# EAGLE design Breadboard (EAGLE 9.6.2)
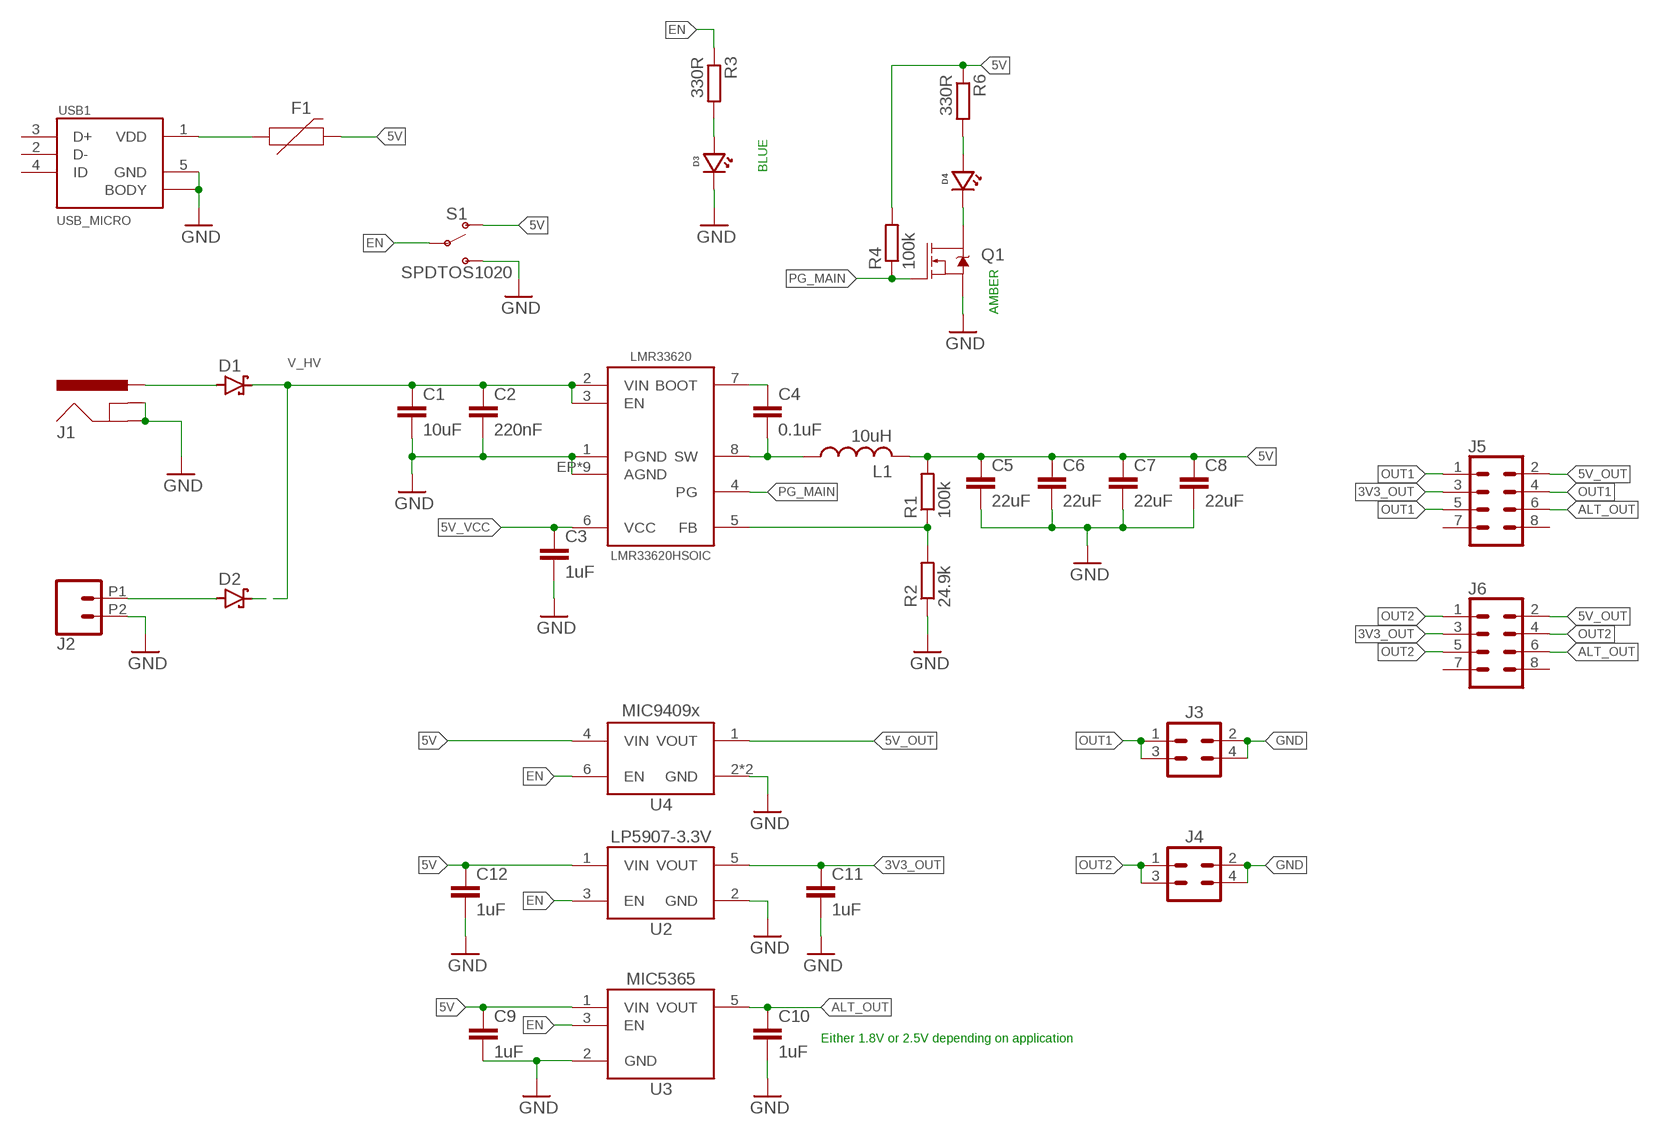
[diagram p0: schematic, sheet 1]

## Parts
C1  10uF  C-EU10UFC0805  [C0805]
C2  220nF  C-EUC0603  [C0603]
C3  1uF  C-EU1UFC0603  [C0603]
C4  0.1uF  C-EU0.1UFC0603  [C0603]
C5  22uF  C-EU22UFC0805  [C0805]
C6  22uF  C-EU22UFC0805  [C0805]
C7  22uF  C-EU22UFC0805  [C0805]
C8  22uF  C-EU22UFC0805  [C0805]
C9  1uF  C-EU1UFC0603  [C0603]
C10  1uF  C-EU1UFC0603  [C0603]
C11  1uF  C-EU1UFC0603  [C0603]
C12  1uF  C-EU1UFC0603  [C0603]
D1  DIODE_SCHOTTKYSOD-123  [SOD-123]
D2  DIODE_SCHOTTKYSOD-123  [SOD-123]
D3  LEDBLUE0603  [LED_0603]
D4  LEDAMBER0603  [LED_0603]
F1  PPTC_HALF-AMP  [1206]
J1  POWER_JACKSLT  [POWER_JACK_SLOT]
J2  CONN_022.54_SCREW  [1X02_2.54_SCREWTERM]
J3  CONN_2X2  [2X02]
J4  CONN_2X2  [2X02]
J5  CONN_04X2  [2X4]
J6  CONN_04X2  [2X4]
L1  10uH  INDUCTORLQS_5X5  [WE-LQS(5X5)]
Q1  MOSFET-NCH-2N7002P  [SOT23-3]
R1  100k  R-EU_100KR0603  [R0603]
R2  24.9k  R-EU_R0603  [R0603]
R3  330R  R-EU_330R0603  [R0603]
R4  100k  R-EU_100KR0603  [R0603]
R6  330R  R-EU_330R0603  [R0603]
S1  SPDTOS1020  [OS102011MS2QN1]
U1  LMR33620HSOIC  [DDS0008J]
U2  LP59073.3VDBV  [SOT23-5]
U3  MIC53651.8SOT23  [SOT23-5]
U4  MIC9409C6  [SC-70_6]
USB1  USB_MICRO  [10118194-0001LF_10118194-0001LF_LONGER_PADS]

## Nets
3V3_OUT: C11.1 J5.3 J6.3 U2.5(VOUT)
5V: C5.1 C6.1 C7.1 C8.1 C9.1 C12.1 F1.2 L1.2 R1.2 R4.2 R6.1 S1.1(O) U2.1(VIN) U3.1(VIN) U4.4(VIN)
5V_OUT: J5.2 J6.2 U4.1(VOUT)
5V_VCC: C3.1 U1.6(VCC)
ALT_OUT: C10.1 J5.6 J6.6 U3.5(VOUT)
EN: R3.1 S1.2(P) U2.3(EN) U3.3(EN) U4.6(EN)
GND: C1.2 C2.2 C3.2 C5.2 C6.2 C7.2 C8.2 C9.2 C10.2 C11.2 C12.2 D3.CATHODE J1.GND@1(GNDBREAK) J1.GND@2(GND) J2.P2 J3.2 J3.4 J4.2 J4.4 Q1.2(S) R2.1 S1.3(S) U1.1(PGND) U1.EP(AGND) U1.EP@1(AGND) U1.EP@2(AGND) U1.EP@3(AGND) U1.EP@4(AGND) U1.EP@5(AGND) U1.EP@6(AGND) U1.EP@7(AGND) U1.EP@8(AGND) U2.2(GND) U3.2(GND) U4.2(GND) U4.5(GND) USB1.5(GND) USB1.BODY@1(BODY) USB1.BODY@2(BODY) USB1.BODY@3(BODY) USB1.BODY@4(BODY) USB1.BODY@7(BODY) USB1.BODY@8(BODY)
N$1: R1.1 R2.2 U1.5(FB)
N$2: D1.ANODE(A) J1.PWR
N$3: D2.ANODE(A) J2.P1
N$4: F1.1 USB1.1(VDD)
N$5: C4.2 L1.1 U1.8(SW)
N$6: C4.1 U1.7(BOOT)
N$9: D4.CATHODE Q1.3(D)
N$11: D3.ANODE R3.2
N$12: D4.ANODE R6.2
OUT1: J3.1 J3.3 J5.1 J5.4 J5.5
OUT2: J4.1 J4.3 J6.1 J6.4 J6.5
PG_MAIN: Q1.1(G) R4.1 U1.4(PG)
V_HV: C1.1 C2.1 D1.CAT(C) D2.CAT(C) U1.2(VIN) U1.3(EN)
Unconnected: J5.7 J5.8 J6.7 J6.8 USB1.2(D-) USB1.3(D+) USB1.4(ID)

## Notes on the sheet
- BLUE
- AMBER
- Either 1.8V or 2.5V depending on application

## Library data of the parts
C1 = bschulz_passives:C-EU: CAPACITOR, European symbol; DIGIKEY: 490-6473-6-ND; MF: Murata; MPN: GRM21BR61C106KE15K
C2 = bschulz_passives:C-EU: CAPACITOR, European symbol
C3 C9-C12 = bschulz_passives:C-EU: CAPACITOR, European symbol; DIGIKEY: 587-1251-1-ND; MF: Yaiyo Yuden; MPN: EMK107BJ105KA-T
C4 = bschulz_passives:C-EU: CAPACITOR, European symbol; DIGIKEY: 490-6051-1-ND; MF: Murata; MPN: GCM188R71E104KA57D
C5-C8 = bschulz_passives:C-EU: CAPACITOR, European symbol; DIGIKEY: 490-9952-1-ND; MF: Murata; MPN: GRM219R61C226ME15L
D1 D2 = bschulz:DIODE_SCHOTTKY: Generic Shottky Diode
D3 = bschulz:LED: Genaric LED; DIGIKEY: 732-4966-1-ND; MF: Wurth; MPN: 150060BS75000
D4 = bschulz:LED: Genaric LED; DIGIKEY: 732-150060AS75000CT-ND; MF: Wurth; MPN: 150060AS75000
F1 = bschulz:PPTC: Bel Fuse PPTC; DIGIKEY: MF-NSMF020-2CT-ND; MF: Bourns; MPN: MF-NSMF020-2
J1 = bschulz:POWER_JACK: Power Jack Connector This is the standard 5.5mm barrel jack for power. The PTH is the most common, proven, reliable, footprint. The Slot footprint only works if the mill layer is transmitted to the PCB fab house so be warned. Here are the connectors we sell at SparkFun: DC Barrel Power Jack/Connector <https://www.sparkfun.com/products/119> (PRT-00119) DC Barrel Power Jack/Connector (SMD) <https://www.sparkfun.com/products/12748> (PRT-12748) DC Barrel Jack Adapter - Breadboard Compatible <https://www.sparkfun.com/products/10811> (PRT-10811) It is used on this SparkFun product (and many, many others): SparkFun RedBoard - Programmed with Arduino <https://www.sparkfun.com/products/12757> (DEV-12757) Also, if you need a mating power supply or connector, please check these out: Wall Adapter Power Supply - 9VDC 650mA <https://www.sparkfun.com/products/298> (TOL-00298) DC Barrel Jack Adapter - Male <https://www.sparkfun.com/products/10287> (PRT-10287); PROD_ID: PRT-00119
J2 = bschulz:CONN_02: Genaric 2 terminal header SCREW_2.54 <https://www.digikey.com/product-detail/en/on-shore-technology-inc/OSTVN02A150/ED10561-ND/1588862> 39532_RA <https://www.digikey.com/product-detail/en/molex/0395321002/WM7845-ND/1280696>; DIGIKEY: ED10561-ND; MF: OnShore; MPN: OSTVN02A150
J3 J4 = bschulz:CONN_2X2: Genaric 2x2 terminal header
J5 J6 = bschulz:CONN_04X2: Multi connection point. Often used as Generic Header-pin footprint for 0.1 inch spaced/style header connections On any of the 0.1 inch spaced packages, you can populate with these: Break Away Headers - Straight <https://www.sparkfun.com/products/116> (PRT-00116) Break Away Male Headers - Right Angle <https://www.sparkfun.com/products/553> (PRT-00553) Female Headers <https://www.sparkfun.com/products/115> (PRT-00115) Break Away Headers - Machine Pin <https://www.sparkfun.com/products/117> (PRT-00117) Break Away Female Headers - Swiss Machine Pin <https://www.sparkfun.com/products/743> (PRT-00743)
L1 = bschulz:INDUCTOR: Genaric inductor
Q1 = bschulz:MOSFET-NCH: N-channel MOSFETs Voltage controlled devices that allow control of high current outputs. SparkFun Products: SparkFun OpenScale <https://www.sparkfun.com/products/13261> SparkFun Digital Sandbox <https://www.sparkfun.com/products/12651> SparkFun Monster Moto Shield <https://www.sparkfun.com/products/10182> SparkFun MOSFET Power Controller <https://www.sparkfun.com/products/11214>; DIGIKEY: 1727-4692-1-ND; MF: Nexperia; MPN: 2N7002P,215
R1 R4 = bschulz_passives:R-EU_: RESISTOR, European symbol Digikey Parts: Yageo, 0402 <https://www.digikey.com/products/en/resistors/chip-resistor-surface-mount/52?k=&pkeyword=&sv=0&s=4356&sf=1&FV=-1%7C13%2C7%7C2%2C1291%7C39157%2C1989%7C0%2C-8%7C52%2C3%7C1131%2C3%7C2503&quantity=&ColumnSort=0&page=1&stock=1&pageSize=25> Yageo, 0603 <https://www.digikey.com/products/en/resistors/chip-resistor-surface-mount/52?k=&pkeyword=&sv=0&pv1291=39245&sf=1&FV=-5%7C4356%2C-5%7C47360%2C-8%7C52%2C-1%7C13%2C7%7C2%2C1989%7C0&quantity=10&ColumnSort=1000011&page=1&stock=1&pageSize=25> Panasonic, 0603 <https://www.digikey.com/products/en/resistors/chip-resistor-surface-mount/52?k=&pkeyword=&pv252=68&sf=0&FV=ffec373d%2C1c0002%2C142c040c%2C1f140000%2Cffe00034%2C80002%2Cc0001&quantity=&ColumnSort=0&page=1&stock=1&pageSize=25> Panasonic, precision, 0603 <https://www.digikey.com/products/en/resistors/chip-resistor-surface-mount/52?FV=ffec4907%2Cfffc000a%2Cc0172%2C142c040c%2C1f140000%2Cffe00034%2C1c0002&quantity=100&ColumnSort=2085&page=1&stock=1&pageSize=25> Panasonic, 0805 <https://www.digikey.com/products/en/resistors/chip-resistor-surface-mount/52?k=&pkeyword=&pv3=1&sf=0&FV=ffec373d%2C1c0002%2C1f140000%2Cffe00034%2C142c040d&quantity=&ColumnSort=0&page=1&stock=1&pageSize=25> Rohm, current sense <https://www.digikey.com/products/en/resistors/chip-resistor-surface-mount/52?k=&pkeyword=&pv3=1&sf=0&FV=ffecb688%2C1f140000%2Cffe00034%2C1c0002&quantity=&ColumnSort=0&page=1&stock=1&pageSize=25> Vishay, pulse proof automotive <https://www.digikey.com/products/en/resistors/chip-resistor-surface-mount/52?k=&pkeyword=&pv7=2&sf=0&FV=ffec5d6b%2Cffe00034%2C1f140000&quantity=&ColumnSort=0&page=1&stock=1&pageSize=25>; DIGIKEY: 311-100KHRCT-ND; MF: Yageo; MPN: RC0603FR-07100KL; VALUE_PART: 100k
R2 = bschulz_passives:R-EU_: RESISTOR, European symbol Digikey Parts: Yageo, 0402 <https://www.digikey.com/products/en/resistors/chip-resistor-surface-mount/52?k=&pkeyword=&sv=0&s=4356&sf=1&FV=-1%7C13%2C7%7C2%2C1291%7C39157%2C1989%7C0%2C-8%7C52%2C3%7C1131%2C3%7C2503&quantity=&ColumnSort=0&page=1&stock=1&pageSize=25> Yageo, 0603 <https://www.digikey.com/products/en/resistors/chip-resistor-surface-mount/52?k=&pkeyword=&sv=0&pv1291=39245&sf=1&FV=-5%7C4356%2C-5%7C47360%2C-8%7C52%2C-1%7C13%2C7%7C2%2C1989%7C0&quantity=10&ColumnSort=1000011&page=1&stock=1&pageSize=25> Panasonic, 0603 <https://www.digikey.com/products/en/resistors/chip-resistor-surface-mount/52?k=&pkeyword=&pv252=68&sf=0&FV=ffec373d%2C1c0002%2C142c040c%2C1f140000%2Cffe00034%2C80002%2Cc0001&quantity=&ColumnSort=0&page=1&stock=1&pageSize=25> Panasonic, precision, 0603 <https://www.digikey.com/products/en/resistors/chip-resistor-surface-mount/52?FV=ffec4907%2Cfffc000a%2Cc0172%2C142c040c%2C1f140000%2Cffe00034%2C1c0002&quantity=100&ColumnSort=2085&page=1&stock=1&pageSize=25> Panasonic, 0805 <https://www.digikey.com/products/en/resistors/chip-resistor-surface-mount/52?k=&pkeyword=&pv3=1&sf=0&FV=ffec373d%2C1c0002%2C1f140000%2Cffe00034%2C142c040d&quantity=&ColumnSort=0&page=1&stock=1&pageSize=25> Rohm, current sense <https://www.digikey.com/products/en/resistors/chip-resistor-surface-mount/52?k=&pkeyword=&pv3=1&sf=0&FV=ffecb688%2C1f140000%2Cffe00034%2C1c0002&quantity=&ColumnSort=0&page=1&stock=1&pageSize=25> Vishay, pulse proof automotive <https://www.digikey.com/products/en/resistors/chip-resistor-surface-mount/52?k=&pkeyword=&pv7=2&sf=0&FV=ffec5d6b%2Cffe00034%2C1f140000&quantity=&ColumnSort=0&page=1&stock=1&pageSize=25>; MF: Yageo
R3 R6 = bschulz_passives:R-EU_: RESISTOR, European symbol Digikey Parts: Yageo, 0402 <https://www.digikey.com/products/en/resistors/chip-resistor-surface-mount/52?k=&pkeyword=&sv=0&s=4356&sf=1&FV=-1%7C13%2C7%7C2%2C1291%7C39157%2C1989%7C0%2C-8%7C52%2C3%7C1131%2C3%7C2503&quantity=&ColumnSort=0&page=1&stock=1&pageSize=25> Yageo, 0603 <https://www.digikey.com/products/en/resistors/chip-resistor-surface-mount/52?k=&pkeyword=&sv=0&pv1291=39245&sf=1&FV=-5%7C4356%2C-5%7C47360%2C-8%7C52%2C-1%7C13%2C7%7C2%2C1989%7C0&quantity=10&ColumnSort=1000011&page=1&stock=1&pageSize=25> Panasonic, 0603 <https://www.digikey.com/products/en/resistors/chip-resistor-surface-mount/52?k=&pkeyword=&pv252=68&sf=0&FV=ffec373d%2C1c0002%2C142c040c%2C1f140000%2Cffe00034%2C80002%2Cc0001&quantity=&ColumnSort=0&page=1&stock=1&pageSize=25> Panasonic, precision, 0603 <https://www.digikey.com/products/en/resistors/chip-resistor-surface-mount/52?FV=ffec4907%2Cfffc000a%2Cc0172%2C142c040c%2C1f140000%2Cffe00034%2C1c0002&quantity=100&ColumnSort=2085&page=1&stock=1&pageSize=25> Panasonic, 0805 <https://www.digikey.com/products/en/resistors/chip-resistor-surface-mount/52?k=&pkeyword=&pv3=1&sf=0&FV=ffec373d%2C1c0002%2C1f140000%2Cffe00034%2C142c040d&quantity=&ColumnSort=0&page=1&stock=1&pageSize=25> Rohm, current sense <https://www.digikey.com/products/en/resistors/chip-resistor-surface-mount/52?k=&pkeyword=&pv3=1&sf=0&FV=ffecb688%2C1f140000%2Cffe00034%2C1c0002&quantity=&ColumnSort=0&page=1&stock=1&pageSize=25> Vishay, pulse proof automotive <https://www.digikey.com/products/en/resistors/chip-resistor-surface-mount/52?k=&pkeyword=&pv7=2&sf=0&FV=ffec5d6b%2Cffe00034%2C1f140000&quantity=&ColumnSort=0&page=1&stock=1&pageSize=25>; DIGIKEY: 311-330HRCT-ND; MF: Yageo; MPN: RC0603FR-07330RL; VALUE_PART: 330
S1 = bschulz:SPDT: Genaric SPDT switch
U1 = bschulz:LMR33620: LMR33620 - Synchronous Step Down Converter (Buck) Characteristics: Vin: 3.8V ~ 36V Vout: 1V ~ 24V Output Current: 2A Operating Temperature: -40°C to 125°C Digikey: 296-51357-1-ND <https://www.digikey.com/en/products/detail/texas-instruments/LMR33620CDDAR/8554846>; DIGIKEY: 296-51357-1-ND; MF: TI; MPN: LMR33620CDDAR
U2 = bschulz:LP5907: LP5907 - Ultra Low Noise, Low IQ LDO Characteristics: Vin: 2.2V ~ 5.5V Vout: 1.8V ~ 4.5V fixed IQ: 12μA typ VDO: 120mV typ at 250mA Voltage Accuracy: ±2% Output Current: 250 mA PSRR: 82 dB at 1kHz Operating Temperature: -40°C to 125°C Digikey: 296-38557-1-ND (3.3V Fixed) <https://www.digikey.com/en/products/detail/texas-instruments/LP5907MFX-3-3-NOPB/3906441> 296-40356-1-ND (2.5V Fixed) <https://www.digikey.com/en/products/detail/texas-instruments/LP5907MFX-2-5-NOPB/5019039>; DIGIKEY: 296-38557-1-ND; DISP: LP5907-3.3V; MF: TI; MPN: LP5907MFX-3.3/NOPB
U3 = bschulz:MIC5365: MIC5365-* - Low Power, High Performance, Linear Regulator Characteristics: Vin: 2.5V ~ 5.5V Vout: Many options, (1v ~ 3.3v) see datasheet <http://ww1.microchip.com/downloads/en/DeviceDoc/mic5365.pdf> IQ: 29μA typ Dropout Voltage: 55mV @ 50mA, input ≥ 2.8v Voltage Accuracy: 2% typ Output Current: 150 mA Operating Temperature: -40°C to 125°C Mouser: MIC5365-3.3YC5 (3.3V Fixed, SC70) <https://www.digikey.com/product-detail/en/microchip-technology/MIC5365-3.3YC5-TR/576-3193-1-ND/1868230> MIC5365-1.8YC5 (1.8V Fixed, SC70) <https://www.digikey.com/products/en/integrated-circuits-ics/pmic-voltage-regulators-linear/699?k=mic5365&k=&pkeyword=mic5365&sv=0&pv1291=881&sf=0&FV=1c0002%2C1f140000%2Cffe002bb%2C1bcc0020&quantity=&ColumnSort=0&page=1&stock=1&pageSize=25> MIC5365-1.8YD5-TR (1.8V Fixed, SOT23) <https://www.digikey.com/en/products/detail/microchip-technology/MIC5365-1-8YD5-TR/3671876>; DIGIKEY: 576-4082-1-ND; MF: Microchip; MPN: MIC5365-1.8YD5-TR
U4 = bschulz:MIC9409*: MIC9409x - Hight Side Load Switch Characteristics: Vin: 1.7V ~ 5.5V IQ: 0.1μA typ, 1μA max RDS(ON): 130mΩ (Vin = 5v), 140mΩ (Vin = 3.6v) Output Current: 1.2A Operating Temperature: -40°C to 125°C Digikey: 576-3484-1-ND <https://www.digikey.com/products/en/integrated-circuits-ics/pmic-power-distribution-switches-load-drivers/726?k=mic94090&k=&pkeyword=mic94090&pv1291=38&sf=0&FV=ffe002d6%2C1c0002&quantity=&ColumnSort=0&page=1&stock=1&pageSize=25>; DISP: MIC9409x; MF: Microchip
USB1 = bschulz:USB_MICRO: General Micro USB - AB Connector; DIGIKEY: 609-4618-1-ND; MF: Amphenol; MPN: 10118194-0001LF

## Board
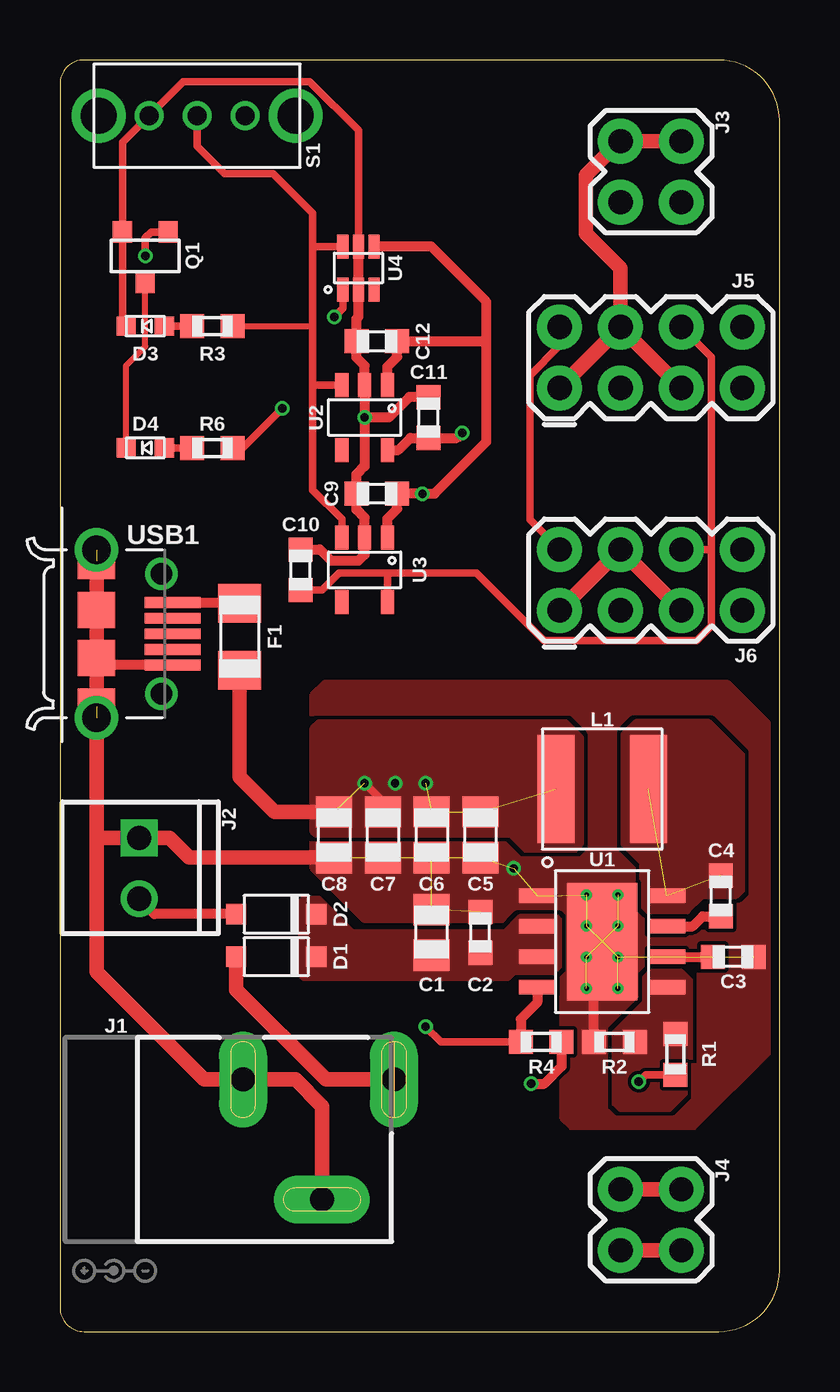
[diagram p1: board, top side]
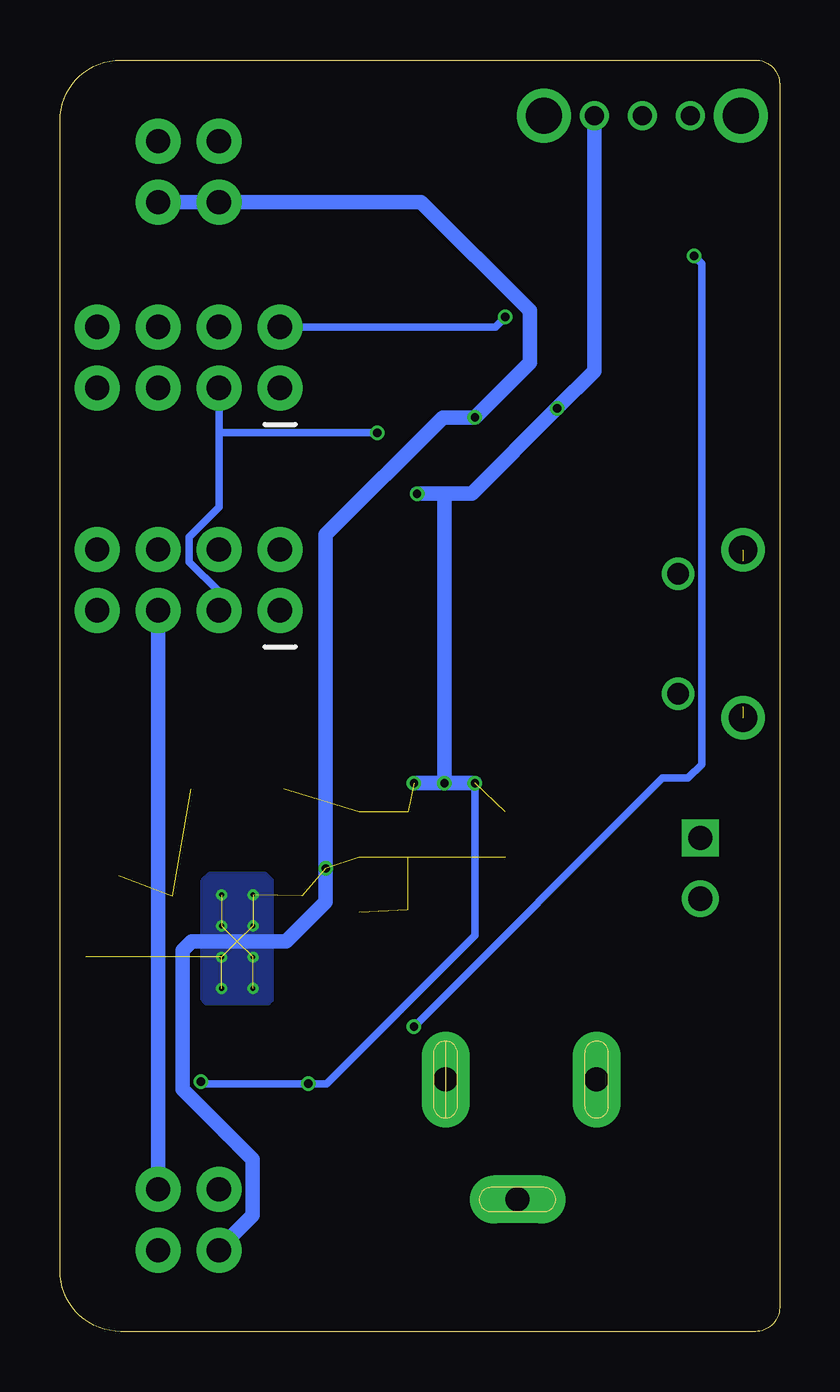
[diagram p2: board, bottom side, seen from below]

Size 30 x 53 mm. Coordinates in mm from the lower left corner, seen from the top.
Outline: 0,52 0,1 arc90 1,0 27.46,0 arc90 30,2.54 30,50.46 arc90 27.46,53 1,53 arc90 0,52
Copper layers (1*16): Top 0.035559375mm / dielectric 1.6mm / Bottom 0.035559375mm
Design rules "oshpark-2layer": minimum track width 6mil, minimum drill 10mil, track to track 6mil, track to pad 6mil, pad to pad 6mil, via to via 6mil, smd to smd 6mil, copper to edge 15mil, drill to drill 6mil, minimum pad ring 5mil, minimum via ring 5mil, stop-mask expansion 2.5mil, vias tented up to drill 0mil, thermal gap 10mil

### Footprints (pad centres in the part's own frame; a part is rotated, then mirrored left to right if it is on the bottom)
C0805 = smd 1.3 x 1.5: 1 -0.95,0; 2 0.95,0
C0603 = smd 1 x 1: 1 -0.85,0; 2 0.85,0
SOD-123 = smd 0.85 x 0.85: ANODE 1.675,0; CAT -1.675,0
LED_0603 = smd 0.8 x 0.8: ANODE 0.8,0; CATHODE -0.8,0
1206 = smd 1.6 x 1.8: 1 -1.4,0; 2 1.4,0
POWER_JACK_SLOT = drill 1 pad 2 long: GND@1 2.58,7.5; GND@2 7.58,10.8; PWR 2.58,13.8
1X02_2.54_SCREWTERM = drill 1.016: P1 1.27,0 | drill 1.016 square: P2 -1.27,0
2X02 = drill 1.016 pad 1.88: 1 0,0; 2 2.54,0; 3 0,-2.54; 4 2.54,-2.54
2X4 = drill 1.016 pad 1.88: 1 -3.81,-1.27; 2 -3.81,1.27; 3 -1.27,-1.27; 4 -1.27,1.27; 5 1.27,-1.27; 6 1.27,1.27; 7 3.81,-1.27; 8 3.81,1.27
WE-LQS(5X5) = smd 1.55 x 4.5: 1 1.925,0; 2 -1.925,0
SOT23-3 = smd 0.8 x 0.9: 1 -0.95,-1; 2 0.95,-1; 3 0,1.1
R0603 = smd 1 x 1: 1 -0.85,0; 2 0.85,0
OS102011MS2QN1 = drill 0.8: 1 -2,0; 2 0,0; 3 2,0 | drill 1.5: BODY@1 -4.1,0; BODY@2 4.1,0
DDS0008J = smd 1.55 x 0.6: 1 -2.7,1.905; 2 -2.7,0.635; 3 -2.7,-0.635; 4 -2.7,-1.905; 5 2.7,-1.905; 6 2.7,-0.635; 7 2.7,0.635; 8 2.7,1.905 | smd 2.95 x 4.9: EP 0,0 | drill 0.2: EP@1 0.65,0.65; EP@2 -0.65,0.65; EP@3 -0.65,1.95; EP@4 0.65,1.95; EP@5 0.65,-1.95; EP@6 0.65,-0.65; EP@7 -0.65,-0.65; EP@8 -0.65,-1.95
SOT23-5 = smd 0.55 x 1: 1 -0.95,-1.35; 2 0,-1.35; 3 0.95,-1.35; 4 0.95,1.35; 5 -0.95,1.35
SC-70_6 = smd 0.47 x 1: 1 -0.65,-0.9; 2 0,-0.9; 3 0.65,-0.9; 4 0.65,0.9; 5 0,0.9; 6 -0.65,0.9
10118194-0001LF_10118194-0001LF_LONGER_PADS = smd 0.45 x 2.35: 1 -1.3,3.175; 2 -0.65,3.175; 3 0,3.175; 4 0.65,3.175; 5 1.3,3.175 | drill 0.9: BBODY@1 -2.5,2.7; BBODY@2 2.5,2.7 | drill 1.2: BODY@1 -3.5,0; BODY@4 3.5,0 | smd 1.5 x 1.55: BODY@2 -1,0; BODY@3 1,0; BODY@7 -3.032,0; BODY@8 3.032,0

### Placement (x,y rotation side)
C1  15.49,16.64 90 top
C2  17.53,16.64 90 top
C3  28.07,15.62 0 top
C4  27.56,18.16 90 top
C5  17.53,20.7 270 top
C6  15.49,20.7 270 top
C7  13.46,20.7 270 top
C8  11.43,20.7 270 top
C9  13.21,34.92 180 top
C10  10.03,31.75 90 top
C11  15.37,38.1 90 top
C12  13.21,41.27 180 top
D1  9.02,15.62 180 top
D2  9.02,17.4 180 top
D3  3.56,41.91 0 top
D4  3.56,36.83 0 top
F1  7.49,28.96 270 top
J1  0.13,13.08 270 top
J2  3.3,19.3 270 top
J3  25.91,49.61 270 top
J4  25.91,5.93 270 top
J5  24.64,40.6 0 top
J6  24.64,31.33 0 top
L1  22.61,22.61 0 top
Q1  3.56,44.83 180 top
R1  25.65,11.56 270 top
R2  23.11,12.06 0 top
R3  6.35,41.91 180 top
R4  20.07,12.06 0 top
R6  6.35,36.83 180 top
S1  5.71,50.67 180 top
U1  22.61,16.26 0 top
U2  12.7,38.1 180 top
U3  12.7,31.75 180 top
U4  12.45,44.32 0 top
USB1  1.52,29.08 270 top

### Tracks (layer width: path | path; a pad name or v marks a point on that pad's centre or on a via)
3V3_OUT  (via drill 0.35)
  Top 0.406: U2.5 14.11,36.75 14.61,37.25 C11.1 16.55,37.25 v16.76,37.47
  Bottom 0.305: J5.3 23.37,37.47 | 23.37,37.47 23.37,34.36 24.61,33.11 24.61,32.08 23.37,30.84 J6.3 | v16.76,37.47 23.37,37.47
5V  (via drill 0.35)  (4 unrouted)
  Top 0.305: v12.7,22.86 13.46,22.1 C7.1 | R1.2 24.42,10.71 v24.13,10.41 | R6.1 7.62,36.83 v9.27,38.48
  Top 0.406: R4.2 20.92,11.05 20.19,10.33 v19.65,10.33 | U4.4 15.48,45.22 17.78,42.93 17.78,41.27 | U2.1 13.65,40.21 14.06,40.62 C12.1 17.78,41.27 | U3.1 13.65,33.88 14.06,34.29 C9.1 v15.11,34.92 15.62,34.92 17.78,37.08 17.78,41.27
  Top 0.61: F1.2 7.49,23.11 8.96,21.65 C8.1
  Bottom 0.305: v12.7,22.86 12.7,16.51 18.88,10.33 v19.65,10.33 24.04,10.33 v24.13,10.41
  Bottom 0.61: v12.7,22.86 v13.97,22.86 | v13.97,22.86 v15.24,22.86 | S1.1 7.71,40.04 v9.27,38.48 12.83,34.92 13.84,34.92 | 13.84,34.92 v15.11,34.92 | 13.84,34.92 13.97,34.8 v13.97,22.86
  pour Top (no thermals): 21.08,25.4 21.72,24.77 21.72,20.32 21.46,20.07 19.43,20.07 18.8,20.7 10.67,20.7 10.54,20.83 10.54,25.15 10.79,25.4
5V_OUT  (via drill 0.35)
  Top 0.305: U4.1 11.8,42.66 v11.43,42.29 | J5.2 20.83,41.09 19.58,39.84 19.58,33.84 J6.2
  Bottom 0.305: v11.43,42.29 11.85,41.87 J5.2
5V_VCC
  Top 0.406: U1.6 C3.1
ALT_OUT
  Top 0.305: C10.1 10.92,30.9 11.64,31.62 13.72,31.62 | U3.5 13.65,31.56 13.72,31.62 | 13.72,31.62 17.37,31.62 20.18,28.81 26.55,28.81 27.15,29.41 27.15,32.64 | J5.6 27.15,40.62 27.15,32.64 | J6.6 27.11,32.6 27.15,32.64
EN
  Top 0.254: R3.1 10.54,41.91
  Top 0.305: U3.3 11.75,33.86 10.54,35.07 10.54,39.5 | 10.54,39.5 10.54,41.91 10.54,45.21 | U4.6 11.79,45.21 10.54,45.21 | U2.3 10.59,39.45 10.54,39.5 | 10.54,45.21 10.54,46.61 8.89,48.26 6.86,48.26 5.71,49.4 S1.2
GND  (via drill 0.35)  (19 unrouted)
  Top 0.305: D3.CATHODE 2.61,42.06 Q1.2 2.61,49.56 S1.3 5.14,52.1 10.41,52.1 12.45,50.06 U4.5
  Top 0.406: R2.1 22.26,14 U1.EP@8 | USB1.5 1.82,27.78 USB1.BODY@3 | U4.5 U4.2 12.45,42.29 12.36,42.2 C12.2 12.36,40.6 12.7,40.26 U2.2 v12.7,38.1 | v12.7,38.1 12.7,36.07 12.36,35.73 C9.2 12.36,34.25 12.7,33.91 U3.2 12.7,32.38 12.45,32.13 11.3,32.13 10.83,32.6 C10.2 | C11.2 14.57,38.95 13.72,38.1 v12.7,38.1
  Top 0.61: 1.52,20.57 USB1.BODY@4 USB1.BODY@3 USB1.BODY@2 USB1.BODY@7 | 1.52,20.57 J2.P2 4.57,20.57 5.39,19.75 C8.2 | J4.4 J4.2 | 1.52,20.57 1.52,14.99 6.01,10.5 J1.GND@1 9.82,10.5 10.93,9.39 J1.GND@2
  Bottom 0.61: J3.2 J3.4 14.94,47.07 10.41,42.55 10.41,40.39 v12.7,38.1 14.03,38.1 18.92,33.21 v18.92,19.3 18.92,17.91 20.57,16.26 24.51,16.26 24.89,15.88 24.89,10.1 21.97,7.18 21.97,4.84 23.37,3.44 J4.4
  pour Top (rank 3, no thermals): 20.07,17.14 12.7,17.14 10.54,19.3 10.54,26.54 11.05,27.05 27.81,27.05 29.59,25.27 29.59,11.68 26.42,8.51 21.34,8.51 20.95,8.89 20.95,16.26
  pour Bottom (no thermals): 21.21,18.8 21.21,13.84 21.34,13.72 23.88,13.72 24,13.84 24,18.8 23.75,19.05 21.46,19.05
N$1
  pour Top (no thermals): 24.38,14.73 24.38,13.72 23.11,12.45 23.11,9.53 23.37,9.27 25.4,9.27 26.29,10.16 26.29,14.61 25.91,14.99 24.64,14.99
N$2
  Top 0.61: J1.PWR 11.09,10.5 7.34,14.25 D1.ANODE
N$3
  Top 0.406: D2.ANODE 3.94,17.4 J2.P1
N$4
  Top 0.406: USB1.1 7.47,30.38 F1.1
N$5  (2 unrouted)
  pour Top (no thermals): 24,25.4 23.5,24.89 23.5,20.32 24.26,19.56 24.26,17.78 24.51,17.53 26.16,17.53 26.8,18.16 28.19,18.16 28.45,18.41 28.45,24 27.05,25.4
N$6
  Top 0.406: U1.7 26.38,16.89 26.8,17.31 C4.1
N$9
  Top 0.254: D4.CATHODE 2.76,40.26 3.56,41.06 Q1.3
N$11
  Top 0.305: R3.2 D3.ANODE
N$12
  Top 0.305: R6.2 D4.ANODE
OUT1
  Top 0.61: J5.4 J5.1 | J5.4 J5.5 | J5.4 23.37,44.32 21.93,45.76 21.93,48.19 23.35,49.61 J3.3 J3.1
OUT2
  Top 0.61: J6.1 J6.4 J6.5 | J4.1 J4.3
  Bottom 0.61: J6.5 25.91,7.32 J4.1
PG_MAIN  (via drill 0.35)
  Top 0.305: R4.1 15.88,12.06 v15.24,12.7 | v3.56,44.83 3.56,45.59 3.79,45.83 Q1.1
  Top 0.406: U1.4 19.91,13.72 19.22,13.03 R4.1
  Bottom 0.305: v3.56,44.83 3.24,44.52 3.24,23.64 3.82,23.06 4.88,23.06 v15.24,12.7
V_HV
  pour Top (no thermals): 20.7,17.27 19.18,17.27 18.54,16.64 12.19,16.64 12.19,14.73 18.67,14.73 18.92,14.99 20.57,14.99 20.83,15.24 20.83,17.14
  pour Top (no thermals): 12.19,14.73 12.19,16.64 10.79,18.03 10.15,18.03 10.03,17.91 10.03,14.86 10.16,14.73

### Text on the board
tDocu: Tosche / Breadboard / v0.0 / Bobby Schulz | OFF | ON | ON | PG | 5V | 3V3 | ALT | NC | ALT: | - | 5~12V | + | 5~12V